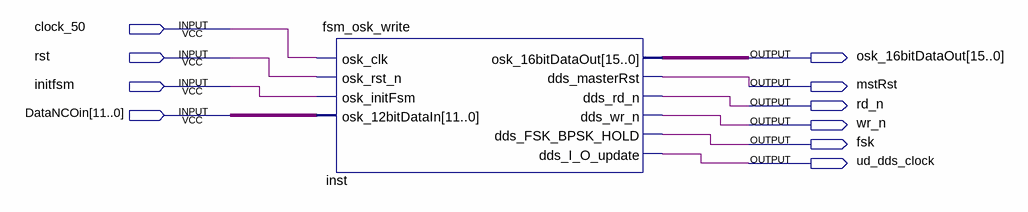
[diagram p0: schematic sheet]
// Quartus schematic osk_blockTest.bdf as structural Verilog: 1 symbols, 10 pins
module osk_blockTest (
  input  clock_50,
  input  rst,
  input  initfsm,
  input  [11:0] DataNCOin,
  output [15:0] osk_16bitDataOut,
  output mstRst,
  output rd_n,
  output wr_n,
  output fsk,
  output ud_dds_clock
);

  fsm_osk_write inst (
    .osk_clk(clock_50), .osk_rst_n(rst), .osk_initFsm(initfsm), .osk_12bitDataIn(DataNCOin),
    .osk_16bitDataOut(osk_16bitDataOut), .dds_masterRst(mstRst), .dds_rd_n(rd_n), .dds_wr_n(wr_n),
    .dds_FSK_BPSK_HOLD(fsk), .dds_I_O_update(ud_dds_clock));
endmodule
